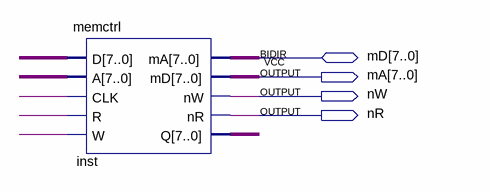
[diagram p0: schematic sheet]
// Quartus schematic memtemp.bdf as structural Verilog: 1 symbols, 4 pins
module memtemp (
  inout  [7:0] mD,
  output [7:0] mA,
  output nW,
  output nR
);

  wire undriven_3, undriven_4, undriven_5;
  wire [7:0] inst_q, undriven, undriven_2;

  memctrl inst (
    .D(undriven), .A(undriven_2), .CLK(undriven_3), .R(undriven_5), .W(undriven_4), .mA(mD), .nW(nW),
    .nR(nR), .Q(inst_q), .mD(mA));
endmodule
